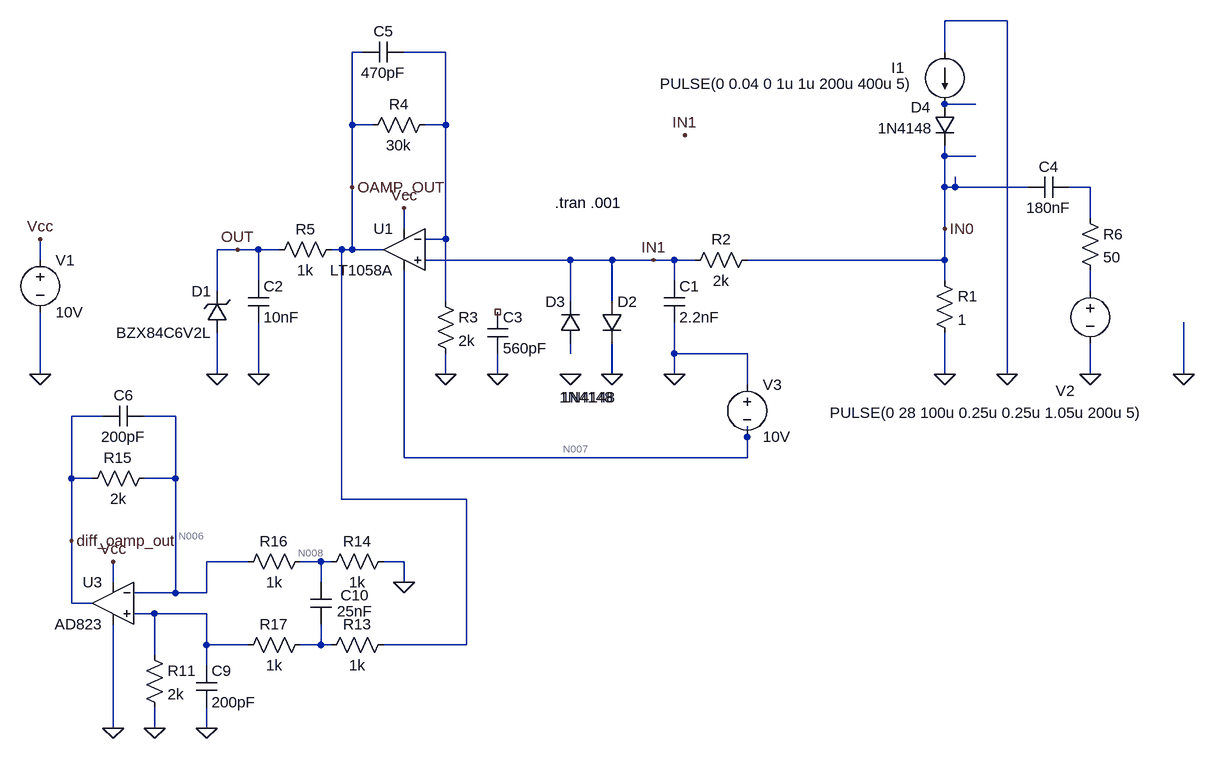
[diagram p0: schematic Filter1.asc]
Filter1.asc, the LTspice schematic file:
Version 4
SHEET 1 1472 1016
WIRE 864 -240 768 -240
WIRE -128 -192 -144 -192
WIRE 0 -192 -64 -192
WIRE 768 -192 768 -240
WIRE 816 -112 768 -112
WIRE -144 -80 -144 -192
WIRE -112 -80 -144 -80
WIRE 0 -80 0 -192
WIRE 0 -80 -32 -80
WIRE 768 -32 768 -48
WIRE 816 -32 768 -32
WIRE -144 16 -144 -80
WIRE 768 16 768 -32
WIRE 784 16 784 0
WIRE 784 16 768 16
WIRE 896 16 784 16
WIRE 992 16 960 16
WIRE 992 64 992 16
WIRE -64 80 -64 48
WIRE 768 80 768 16
WIRE 0 96 0 -80
WIRE 0 96 -32 96
WIRE -320 112 -352 112
WIRE -288 112 -320 112
WIRE -256 112 -288 112
WIRE -160 112 -176 112
WIRE -144 112 -144 16
WIRE -144 112 -160 112
WIRE -96 112 -144 112
WIRE -624 128 -624 96
WIRE 192 128 -32 128
WIRE 256 128 192 128
WIRE 320 128 256 128
WIRE 352 128 320 128
WIRE 384 128 352 128
WIRE 768 128 768 80
WIRE 768 128 464 128
WIRE -288 160 -288 112
WIRE 352 160 352 128
WIRE 768 160 768 128
WIRE -352 176 -352 112
WIRE 992 176 992 144
WIRE 0 192 0 96
WIRE 192 192 192 128
WIRE 256 192 256 128
WIRE 192 272 192 256
WIRE 352 272 352 224
WIRE 464 272 352 272
WIRE -624 304 -624 208
WIRE -352 304 -352 240
WIRE -288 304 -288 224
WIRE 0 304 0 272
WIRE 80 304 80 272
WIRE 256 304 256 256
WIRE 352 304 352 272
WIRE 768 304 768 240
WIRE 864 304 864 -240
WIRE 992 304 992 256
WIRE 1136 304 1136 224
WIRE 464 320 464 272
WIRE -528 368 -576 368
WIRE -416 368 -464 368
WIRE 464 400 464 384
WIRE -64 432 -64 144
WIRE 464 432 464 400
WIRE 464 432 -64 432
WIRE -576 464 -576 368
WIRE -544 464 -576 464
WIRE -416 464 -416 368
WIRE -416 464 -464 464
WIRE -160 496 -160 112
WIRE 32 496 -160 496
WIRE -576 560 -576 464
WIRE -304 592 -368 592
WIRE -192 592 -224 592
WIRE -176 592 -192 592
WIRE -64 592 -96 592
WIRE -512 624 -512 592
WIRE -192 624 -192 592
WIRE -64 624 -64 592
WIRE -416 640 -416 464
WIRE -416 640 -480 640
WIRE -368 640 -368 592
WIRE -368 640 -416 640
WIRE -576 656 -576 560
WIRE -544 656 -576 656
WIRE -448 672 -480 672
WIRE -368 672 -448 672
WIRE -368 720 -368 672
WIRE -304 720 -368 720
WIRE -192 720 -192 688
WIRE -192 720 -224 720
WIRE -176 720 -192 720
WIRE 32 720 32 496
WIRE 32 720 -96 720
WIRE -448 736 -448 672
WIRE -368 752 -368 720
WIRE -512 848 -512 688
WIRE -448 848 -448 816
WIRE -368 848 -368 816
FLAG 768 304 0
FLAG 352 304 0
FLAG 0 304 0
FLAG -288 304 0
FLAG -64 48 Vcc
FLAG -352 304 0
FLAG 192 304 0
FLAG 256 304 0
FLAG -624 304 0
FLAG -624 96 Vcc
FLAG 80 304 0
FLAG 864 304 0
FLAG -144 16 OAMP_OUT
FLAG -320 112 OUT
FLAG 768 80 IN0
FLAG 320 128 IN1
FLAG 992 304 0
FLAG 368 -64 IN1
FLAG 1136 304 0
FLAG -448 848 0
FLAG -512 848 0
FLAG -512 592 Vcc
FLAG -368 848 0
FLAG -64 624 0
FLAG -576 560 diff_oamp_out
SYMBOL res 752 144 R0
SYMATTR InstName R1
SYMATTR Value 1
SYMBOL cap 336 160 R0
SYMATTR InstName C1
SYMATTR Value 2.2nF
SYMBOL res 480 112 R90
WINDOW 0 0 56 VBottom 2
WINDOW 3 32 56 VTop 2
SYMATTR InstName R2
SYMATTR Value 2k
SYMBOL res -16 176 R0
SYMATTR InstName R3
SYMATTR Value 2k
SYMBOL res -16 -96 R90
WINDOW 0 0 56 VBottom 2
WINDOW 3 32 56 VTop 2
SYMATTR InstName R4
SYMATTR Value 30k
SYMBOL res -160 96 R90
WINDOW 0 0 56 VBottom 2
WINDOW 3 32 56 VTop 2
SYMATTR InstName R5
SYMATTR Value 1k
SYMBOL cap -304 160 R0
SYMATTR InstName C2
SYMATTR Value 10nF
SYMBOL voltage -624 112 R0
WINDOW 123 0 0 Left 2
WINDOW 39 0 0 Left 2
SYMATTR InstName V1
SYMATTR Value 10V
SYMBOL zener -336 240 R180
WINDOW 0 24 64 Left 2
WINDOW 3 24 0 Left 2
SYMATTR InstName D1
SYMATTR Value BZX84C6V2L
SYMBOL diode 240 192 R0
WINDOW 3 -62 147 Left 2
SYMATTR Value 1N4148
SYMATTR InstName D2
SYMBOL diode 208 256 R180
WINDOW 0 24 64 Left 2
WINDOW 3 -52 -83 Left 2
SYMATTR InstName D3
SYMATTR Value 1N4148
SYMBOL cap 64 208 R0
SYMATTR InstName C3
SYMATTR Value 560pF
SYMBOL current 768 -192 R0
WINDOW 0 -82 24 Left 2
WINDOW 3 -438 49 Left 2
WINDOW 123 0 0 Left 2
WINDOW 39 0 0 Left 2
SYMATTR InstName I1
SYMATTR Value PULSE(0 0.04 0 1u 1u 200u 400u 5)
SYMBOL voltage 992 160 R0
WINDOW 123 0 0 Left 2
WINDOW 39 0 0 Left 2
WINDOW 0 -53 169 Left 2
WINDOW 3 -401 203 Left 2
SYMATTR InstName V2
SYMATTR Value PULSE(0 28 100u 0.25u 0.25u 1.05u 200u 5)
SYMBOL res 976 48 R0
SYMATTR InstName R6
SYMATTR Value 50
SYMBOL cap 960 0 R90
WINDOW 0 0 32 VBottom 2
WINDOW 3 32 32 VTop 2
SYMATTR InstName C4
SYMATTR Value 180nF
SYMATTR SpiceLine Lser=100.7uH
SYMBOL cap -64 -208 R90
WINDOW 0 0 32 VBottom 2
WINDOW 3 32 32 VTop 2
SYMATTR InstName C5
SYMATTR Value 470pF
SYMBOL diode 752 -112 R0
WINDOW 3 -87 37 Left 2
WINDOW 0 -36 5 Left 2
SYMATTR Value 1N4148
SYMATTR InstName D4
SYMBOL res -464 720 R0
SYMATTR InstName R11
SYMATTR Value 2k
SYMBOL cap -384 752 R0
SYMATTR InstName C9
SYMATTR Value 200pF
SYMBOL Opamps\\AD823 -512 592 M0
SYMATTR InstName U3
SYMBOL res -80 704 R90
WINDOW 0 0 56 VBottom 2
WINDOW 3 32 56 VTop 2
SYMATTR InstName R13
SYMATTR Value 1k
SYMBOL res -80 576 R90
WINDOW 0 0 56 VBottom 2
WINDOW 3 32 56 VTop 2
SYMATTR InstName R14
SYMATTR Value 1k
SYMBOL res -448 448 R90
WINDOW 0 0 56 VBottom 2
WINDOW 3 32 56 VTop 2
SYMATTR InstName R15
SYMATTR Value 2k
SYMBOL res -208 576 R90
WINDOW 0 0 56 VBottom 2
WINDOW 3 32 56 VTop 2
SYMATTR InstName R16
SYMATTR Value 1k
SYMBOL res -208 704 R90
WINDOW 0 0 56 VBottom 2
WINDOW 3 32 56 VTop 2
SYMATTR InstName R17
SYMATTR Value 1k
SYMBOL cap -208 624 R0
WINDOW 0 46 20 Left 2
WINDOW 3 41 44 Left 2
SYMATTR InstName C10
SYMATTR Value 25nF
SYMBOL cap -464 352 R90
WINDOW 0 0 32 VBottom 2
WINDOW 3 32 32 VTop 2
SYMATTR InstName C6
SYMATTR Value 200pF
SYMBOL voltage 464 304 R0
WINDOW 123 0 0 Left 2
WINDOW 39 0 0 Left 2
SYMATTR InstName V3
SYMATTR Value 10V
SYMBOL Opamps\\LT1058A -64 48 M0
SYMATTR InstName U1
TEXT 168 40 Left 2 !.tran .001

The netlist it stands for:
* Filter1.asc
R1 IN0 0 1
C1 IN1 0 2.2nF
R2 IN0 IN1 2k
R3 N001 0 2k
R4 N001 OAMP_OUT 30k
R5 OAMP_OUT OUT 1k
C2 OUT 0 10nF
V1 Vcc 0 10V
D1 0 OUT BZX84C6V2L
D2 IN1 0 1N4148
D3 N005 IN1 1N4148
C3 NC_01 0 560pF
I1 0 N002 PULSE(0 0.04 0 1u 1u 200u 400u 5)
V2 N004 0 PULSE(0 28 100u 0.25u 0.25u 1.05u 200u 5)
R6 N003 N004 50
C4 N003 IN0 180nF Lser=100.7uH
C5 N001 OAMP_OUT 470pF
D4 N002 IN0 1N4148
R11 N009 0 2k
C9 N009 0 200pF
XU3 N009 N006 Vcc 0 diff_oamp_out AD823  ; pins In+ In- V+ V- OUT
R13 OAMP_OUT N010 1k
R14 0 N008 1k
R15 N006 diff_oamp_out 2k
R16 N008 N006 1k
R17 N010 N009 1k
C10 N008 N010 25nF
C6 N006 diff_oamp_out 200pF
V3 0 N007 10V
XU1 IN1 N001 Vcc N007 OAMP_OUT LT1058A  ; pins In+ In- V+ V- OUT
.model D D
.lib standard.dio
.tran .001
.lib ADI.lib
.backanno
.end

* Results of the author's LTspice run, read from the files saved beside the schematic
* Operating Point, zero values left out:
*   V(vcc) = 10 V
*   V(n006) = 17.37 mV
*   V(diff_oamp_out) = 34.75 mV
*   V(n008) = 8.687 mV
*   V(n007) = -10 V
*   I(R17) = -2.75 pA
*   I(R16) = -8.687 µA
*   I(R15) = -8.687 µA
*   I(R14) = -8.687 µA
*   I(R13) = -2.75 pA
*   I(R11) = 2.75 pA
*   I(V3) = -1.6 mA
*   I(V1) = -4.698 mA
*   Ix(u3:1) = -5.5 pA
*   Ix(u3:2) = -5.498 pA
*   Ix(u3:3) = 3.098 mA
*   Ix(u3:4) = -3.091 mA
*   Ix(u3:5) = -8.687 µA
*   Ix(u1:3) = 1.6 mA
*   Ix(u1:4) = -1.6 mA
*   Ix(u1:5) = 2.75 pA
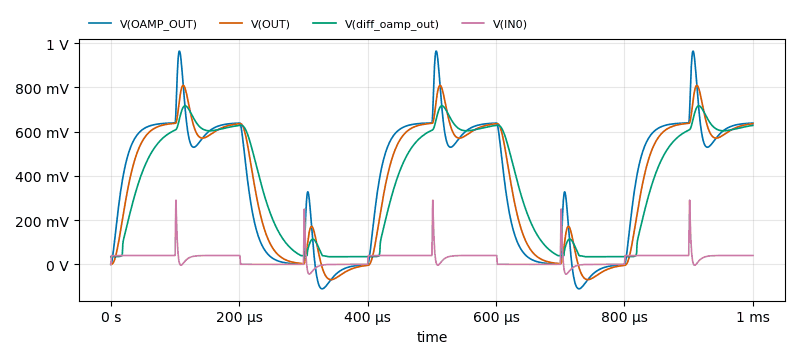
[diagram p1: Transient Analysis of Filter1.asc, plotted from the saved traces]
* Transient Analysis, 1 run:
*   V(OAMP_OUT): min -110.5 mV, max 962.9 mV, average 373.1 mV, rms 477.4 mV, last 638.2 mV
*   V(OUT): min -69.01 mV, max 808.8 mV, average 366.7 mV, rms 465.7 mV, last 635.3 mV
*   V(diff_oamp_out): min 34.53 mV, max 716.6 mV, average 363.7 mV, rms 444.3 mV, last 627.8 mV
*   V(IN0): min -43.95 mV, max 290.1 mV, average 24.1 mV, rms 38.59 mV, last 40 mV